# Altium schematic sheet 5_AudioIO.SchDoc
size B; SheetNumber: 5; SheetTotal: 6
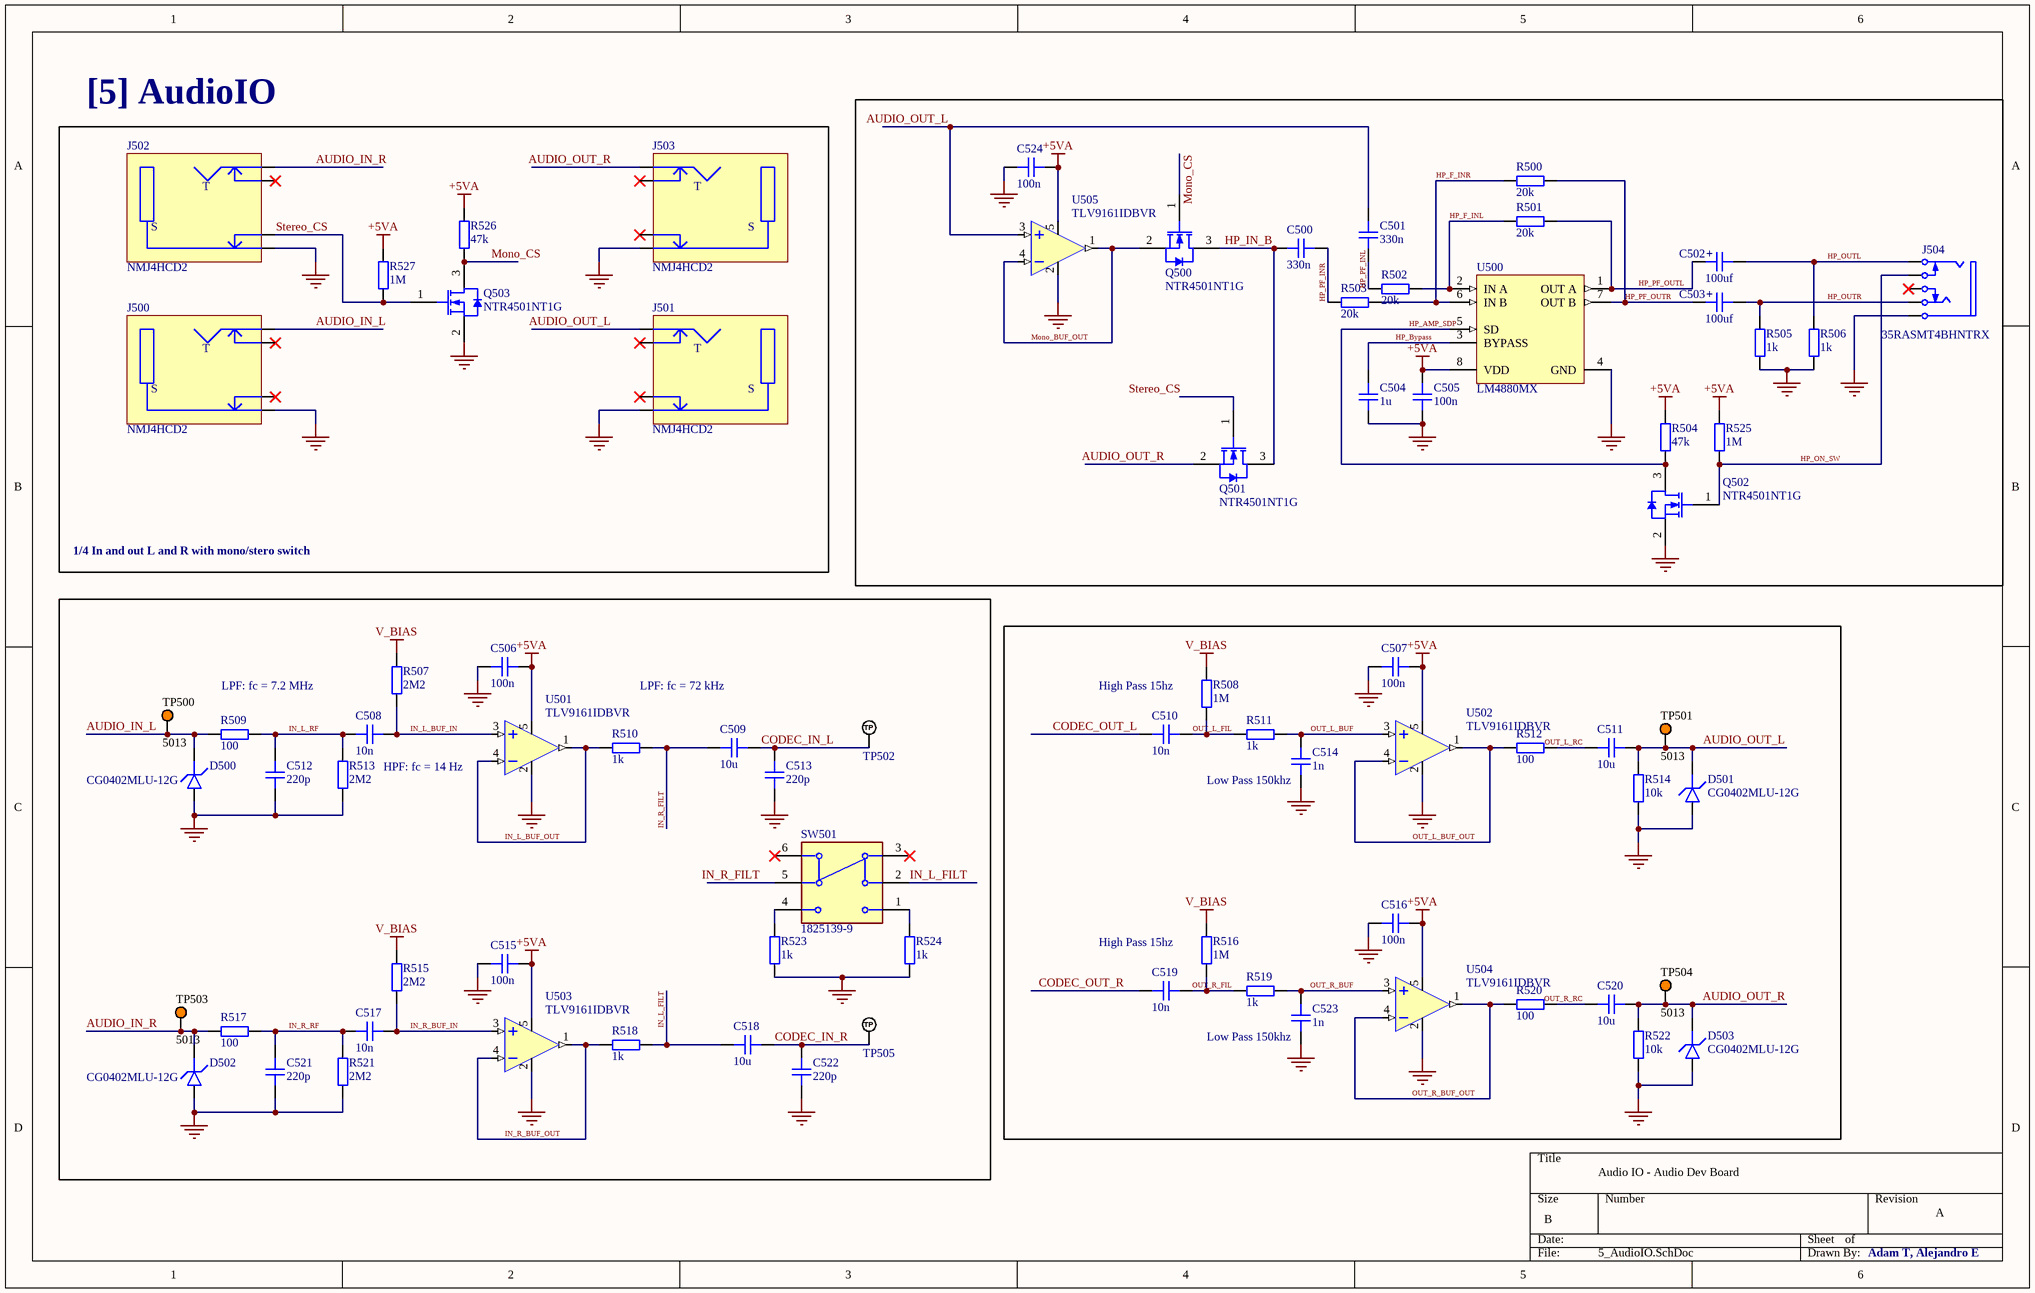
[diagram p0: 5_AudioIO.SchDoc]

## Parts
C500  330n  [CAP_0603]
C501  330n  [CAP_0603]
C502  100uf  [CAP_AE_SMD_D6MM3_H5M55]
C503  100uf  [CAP_AE_SMD_D6MM3_H5M55]
C504  1u  [CAP_0603]
C505  100n  [CAP_0402]
C506  100n  [CAP_0402]
C507  100n  [CAP_0402]
C508  10n  [CAP_0402]
C509  10u  [CAP_0603]
C510  10n  [CAP_0402]
C511  10u  [CAP_0603]
C512  220p  [CAP_0402]
C513  220p  [CAP_0402]
C514  1n  [CAP_0402]
C515  100n  [CAP_0402]
C516  100n  [CAP_0402]
C517  10n  [CAP_0402]
C518  10u  [CAP_0603]
C519  10n  [CAP_0402]
C520  10u  [CAP_0603]
C521  220p  [CAP_0402]
C522  220p  [CAP_0402]
C523  1n  [CAP_0402]
C524  100n  [CAP_0402]
D500  CG0402MLU-12G  [D_0402]
D501  CG0402MLU-12G  [D_0402]
D502  CG0402MLU-12G  [D_0402]
D503  CG0402MLU-12G  [D_0402]
J500  NMJ4HCD2  [NMJ4HCD2]
J501  NMJ4HCD2  [NMJ4HCD2]
J502  NMJ4HCD2  [NMJ4HCD2]
J503  NMJ4HCD2  [NMJ4HCD2]
J504  35RASMT4BHNTRX  [SWIT-35RASMT4BHNTRX_V]
Q500  NTR4501NT1G  [ONSC-SOT-23-3-318-08_V]
Q501  NTR4501NT1G  [ONSC-SOT-23-3-318-08_V]
Q502  NTR4501NT1G  [ONSC-SOT-23-3-318-08_V]
Q503  NTR4501NT1G  [ONSC-SOT-23-3-318-08_V]
R500  20k  [RES_0402]
R501  20k  [RES_0402]
R502  20k  [RES_0402]
R503  20k  [RES_0402]
R504  47k  [RES_0402]
R505  1k  [RES_0402]
R506  1k  [RES_0402]
R507  2M2  [RES_0402]
R508  1M  [RES_0402]
R509  100  [RES_0402]
R510  1k  [RES_0402]
R511  1k  [RES_0402]
R512  100  [RES_0402]
R513  2M2  [RES_0402]
R514  10k  [RES_0402]
R515  2M2  [RES_0402]
R516  1M  [RES_0402]
R517  100  [RES_0402]
R518  1k  [RES_0402]
R519  1k  [RES_0402]
R520  100  [RES_0402]
R521  2M2  [RES_0402]
R522  10k  [RES_0402]
R523  1k  [RES_0402]
R524  1k  [RES_0402]
R525  1M  [RES_0402]
R526  47k  [RES_0402]
R527  1M  [RES_0402]
SW501  1825139-9  [FP-1825139-9-MFG]
TP500  5013  [KSTN-5013_V]
TP501  5013  [KSTN-5013_V]
TP502  TP_NOBOM  [PAD_RND_1MM]  (value not drawn)  (no BOM)
TP503  5013  [KSTN-5013_V]
TP504  5013  [KSTN-5013_V]
TP505  TP_NOBOM  [PAD_RND_1MM]  (value not drawn)  (no BOM)
U500  LM4880MX  [M08A_L]
U501  TLV9161IDBVR  [SOT-23-5]
U502  TLV9161IDBVR  [SOT-23-5]
U503  TLV9161IDBVR  [SOT-23-5]
U504  TLV9161IDBVR  [SOT-23-5]
U505  TLV9161IDBVR  [SOT-23-5]

## Blocks framed on the sheet
[5] AudioIO: J500-J503 Q503 R526 R527

## Nets
+5VA: C505.2 C506.2 C507.2 C515.2 C516.2 C524.2 R504.2 R525.2 R526.1 R527.1 U500.8(VDD) U501.5(V+) U502.5(V+) U503.5(V+) U504.5(V+) U505.5(V+)
GND: C504.1 C505.1 C506.1 C507.1 C512.1 C513.1 C514.1 C515.1 C516.1 C521.1 C522.1 C523.1 C524.1 D500.A D501.A D502.A D503.A J500.S J501.S J502.S J503.S J504.1 Q502.2(S) Q503.2(S) R505.1 R506.1 R513.1 R514.2 R521.1 R522.2 R523.1 R524.1 U500.4(GND) U501.2(V-) U502.2(V-) U503.2(V-) U504.2(V-) U505.2(V-)
V_BIAS: R507.2 R508.2 R515.2 R516.2
AUDIO_IN_L: D500.K J500.T R509.1 TP500.1
AUDIO_IN_R: D502.K J502.T R517.1 TP503.1
AUDIO_OUT_L: C501.1 C511.2 D501.K J501.T R514.1 TP501.1 U505.3(IN+)
AUDIO_OUT_R: C520.2 D503.K J503.T Q501.2(S) R522.1 TP504.1
CODEC_IN_L: C509.1 C513.2 TP502.1(TP)
CODEC_IN_R: C518.1 C522.2 TP505.1(TP)
CODEC_OUT_L: C510.1
CODEC_OUT_R: C519.1
HP_AMP_SDP: Q502.3(D) R504.1 U500.5(SD)
HP_Bypass: C504.2 U500.3(BYPASS)
HP_F_INL: R501.1 R502.2 U500.2(IN_A)
HP_F_INR: R500.1 R503.2 U500.6(IN_B)
HP_IN_B: C500.2 Q500.3(D) Q501.3(D)
HP_ON_SW: J504.4 Q502.1(G) R525.1
HP_OUTL: C502.2 J504.2 R506.2
HP_OUTR: C503.2 J504.3 R505.2
HP_PF_INL: C501.2 R502.1
HP_PF_INR: C500.1 R503.1
HP_PF_OUTL: C502.1 R501.2 U500.1(OUT_A)
HP_PF_OUTR: C503.1 R500.2 U500.7(OUT_B)
IN_L_BUF_IN: C508.2 R507.1 U501.3(IN+)
IN_L_BUF_OUT: R510.1 U501.1(OUT) U501.4(IN-)
IN_L_FILT: C518.2 R518.2 SW501.2
IN_L_RF: C508.1 C512.2 R509.2 R513.2
IN_R_BUF_IN: C517.2 R515.1 U503.3(IN+)
IN_R_BUF_OUT: R518.1 U503.1(OUT) U503.4(IN-)
IN_R_FILT: C509.2 R510.2 SW501.5
IN_R_RF: C517.1 C521.2 R517.2 R521.2
Mono_BUF_OUT: Q500.2(S) U505.1(OUT) U505.4(IN-)
Mono_CS: Q500.1(G) Q503.3(D) R526.2
OUT_L_BUF: C514.2 R511.1 U502.3(IN+)
OUT_L_BUF_OUT: R512.2 U502.1(OUT) U502.4(IN-)
OUT_L_FIL: C510.2 R508.1 R511.2
OUT_L_RC: C511.1 R512.1
OUT_R_BUF: C523.2 R519.1 U504.3(IN+)
OUT_R_BUF_OUT: R520.2 U504.1(OUT) U504.4(IN-)
OUT_R_FIL: C519.2 R516.1 R519.2
OUT_R_RC: C520.1 R520.1
Stereo_CS: J502.SN Q501.1(G) Q503.1(G) R527.2
NetR523_2: R523.2 SW501.4
NetR524_2: R524.2 SW501.1

Not connected (* = marked no-connect by the designer): J500 SN* TN*; J501 SN* TN*; J502 TN*; J503 SN* TN*; J504 5*; SW501 3* 6*

## Notes on the sheet
- 1/4 In and out L and R with mono/stero switch
- LPF: fc = 7.2 MHz
- LPF: fc = 72 kHz
- (near R508) High Pass 15hz
- HPF: fc = 14 Hz
- (near C514) Low Pass 150khz
- (near R516) High Pass 15hz
- (near C523) Low Pass 150khz
- Audio IO - Audio Dev Board
- A
- Adam T, Alejandro E
- (in symbol CAP_ALEL_6.3x5.5) +

## Library data of the parts
C500 C501 C504 C509 C511 C518 C520 = CAP_0603: Capacitor SMD 0603; Manufacturer: *; Manufacturer Part Number: *; Distributor Link: *; LCSC: *; Rating: *; Dielectric: *
C502 C503 = CAP_ALEL_6.3x5.5: Capacitor SMD Aluminium Electrolytic 6.3mm Diameter 5.5mm Height / RVT1C101M0605 / C37308; Manufacturer: *; Manufacturer Part Number: *; Distributor Link: *; LCSC: *
C505-C508 C510 C512-C517 C519 C521-C524 = CAP_0402: Capacitor SMD 0402; Manufacturer: *; Manufacturer Part Number: *; Distributor Link: *; LCSC: *; Rating: *; Dielectric: *
D500-D503 = D_TVS_0402: Diode TVS / ESD 0402
J500-J503 = NMJ4HCD2: 1/4" Mono Jack, TS Switched; Manufacturer: Neutrik; Manufacturer Part Number: NMJ4HCD2
J504 = CMP-1772-00001-1: Female 3.5 mm Phone Jack, 5 Position, Height 5 mm, RoHS, Tape and Reel; Current Rating: 50 mA; Voltage Rating (DC): 12 V; ComponentLink1URL: http://www.switchcraft.com/; ComponentLink2Description: Datasheet; ComponentLink2URL: http://www.switchcraft.com/Drawings/35rasmt4bhntrx_cd.pdf; PackageDescription: Female 3.5 mm Phone Jack, 5 Position, Height 5 mm; PackageReference: 35RASMT4BHNTRX; Mount: Through Hole; DatasheetVersion: Rev. C, 07/2014; Contact Material: Silver; ComponentLink1Description: Manufacturer URL; Packaging: Tape and Reel; RoHSCompliant: true; Contact Plating: Silver; Package Quantity: 3000
Q500-Q503 = CMP-1058-00732-1: Power MOSFET, 20 V, 3.2 A, Single N-Channel, 3-Pin SOT-23, Pb-Free, Tape and Reel; Manufacturer: On Semiconductor; VGS Max (V): 12; VGS(th) Max (V): 1.2; PD Max (W): 1.25; Coss Typ (pF): 80; Ciss Typ (pF): 200; V(BR)DSS Min (V): 20; Qrr Typ (nC): 3; Crss Typ (pF): 50; Channel Polarity: N Channel; RoHS: Pb-Free; ComponentLink3URL: http://www.onsemi.cn/pub_link/Collateral/318-08.PDF; ComponentLink2Description: Datasheet; PackageVersion: Rev. AP, 11/2009; Mounting Technology: Surface Mount; PackageDescription: 3-Pin Small Outline Transistor, Body 2.92 x 1.3 mm, Pitch 0.95 mm; PackageReference: SOT-23-3-318-08; ComponentLink1URL: http://www.onsemi.com/; Packing: Tape and Reel; Configuration: Single; ComponentLink2URL: http://www.onsemi.cn/pub_link/Collateral/NTR4501N-D.PDF; ComponentLink3Description: Package Specification; Package Type: SOT-23-3; ComponentLink1Description: Manufacturer URL; PartNumber: NTR4501NT1G; DatasheetVersion: Rev. 13
R500-R527 = RES_0402: Resistor SMD 0402; Manufacturer: *; Manufacturer Part Number: *; Distributor Link: *; LCSC: *
SW501 = CMP-03408-000019-1: SWITCH TOGGLE DPDT 5A 120V; Voltage Rating (AC): 125V; Illumination Type: Non-Illuminated; Sealable: Yes (With); Insulation Resistance: 1GR; Actuator Length: 10.41mm; Max Voltage Rating (AC): 250V; Actuator Material: Brass; Max Voltage Rating (DC): 28V; Switch Function: On-Off-On; Actuator Color: Chrome; Actuator Type: Standard Round; Electrical Life: 6000Cycles; Contact Resistance: 10MR; ELV: Compliant; Orientation: Straight; Series: Gemini A; RoHS Compliant: Yes; Termination: PC Pins; Max Operating Temperature: 85°C; Radiation Hardening: No; Contact Plating: Silver; Contact Material: Copper; Mount: Through Hole; Packaging: Bulk; Flammability Rating: UL94 V-1; Contact Current Rating: 5A; Throw Configuration: DPDT; Voltage Rating (DC): 28V; Type: Switch; Min Operating Temperature: -30°C
TP500 TP501 TP503 TP504 = CMP-1672-00005-4: Test Point, Orange, Through Hole, RoHS, Bulk; Manufacturer: Keystone; REACH SVHC: No SVHC; ComponentLink2Description: Datasheet; PackageDescription: 1-Pin Through Hole Device, Dia 3.17 mm; Package Quantity: 100; PackageReference: 5013; Contact Material: Bronze; DatasheetVersion: Rev. F, 12/2013; ComponentLink2URL: http://www.keyelco.com/product-pdf.cfm?p=1322; Contact Plating: Silver; ComponentLink1URL: http://www.keyelco.com/; Packaging: Bulk; ComponentLink1Description: Manufacturer URL; Colour: Orange; Height: 8.12 mm; RoHSCompliant: True; Mount: Through Hole; Mounting Technology: Through Hole
TP502 TP505 = TEST_POINT_RND_1MM: Test Point Round 1mm (NO BOM)
U500 = CMP-0057-00417-2: Dual 200mW Audio Power Amplifier with Shutdown Mode, 8-pin Narrow SOIC; Manufacturer: National Semiconductor; PackageTopMarking: NSZXTT*LM*4880M; PowerWise: N; CompType: Audio IC; PackageVersion: revM, May-2009; RevisionNote: Component URLs added; Code_IPC: SOIC127P600-8; ComponentLink2Description: LM4880 Web Page; ComponentLink3URL: http://www.national.com/packaging/folders/m08a.html; PackageDescription: SOIC Narrow, 4.9 x 3.9 x 1.45mm, 8 Lead, 1.27mm Pitch; PackageReference: M08A; PinCount: 8; RoHS: N; Code_JEDEC: MS-012-AA; ComponentLink1Description: LM4880 Datasheet; ComponentLink3Description: M08A Package Page; DatasheetVersion: Sep-2004; ComponentLink2URL: http://www.national.com/pf/LM/LM4880.html; ComponentLink1URL: http://www.national.com/ds/LM/LM4880.pdf
U501-U505 = TLV9161IDBVR: TLV916x 16-V, 11-MHz, Rail-to-Rail Input/Output, Low Offset Voltage, Low Noise Op Amp SOT-23-5; Manufacturer: Texas Instruments; Manufacturer Part Number: TLV9161IDBVR